# Altium schematic sheet ESP32.SchDoc
size A4
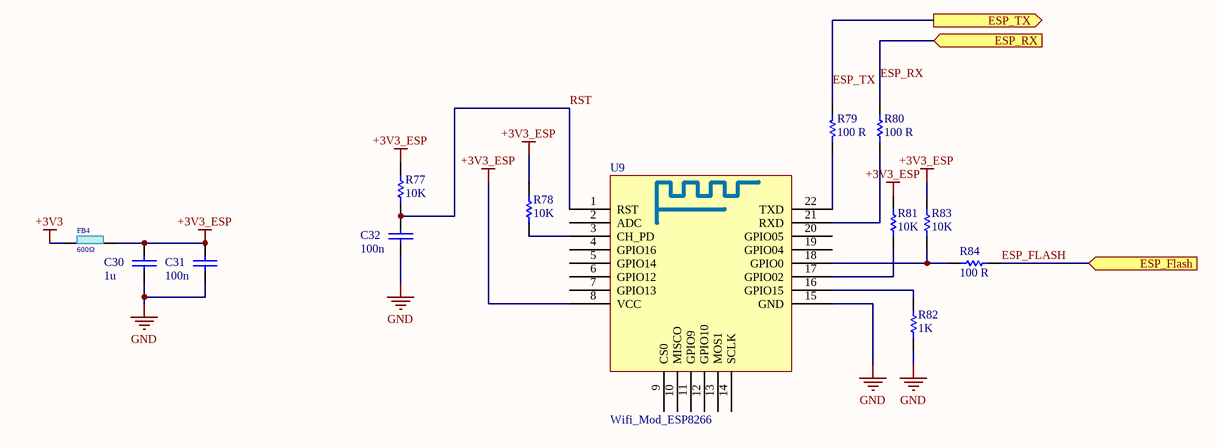
[diagram p0: ESP32.SchDoc]

## Parts
C30  1u  [C1206]
C31  100n  [C1206]
C32  100n  [C1206]
FB4  ZTyp@100MHz: 600Ω  [L1206]  (hidden comment: 0.955u)
R77  10K  [R1206]
R78  10K  [R1206]
R79  100 R  [R1206]
R80  100 R  [R1206]
R81  10K  [R1206]
R82  1K  [R1206]
R83  10K  [R1206]
R84  100 R  [R1206]
U9  Wifi_Mod_ESP8266  [PCBComponent_1 - duplicate]

## Ports
ESP_Flash (in), ESP_RX (in), ESP_TX (out)

## Nets
+3V3: FB4.1
+3V3_ESP: C30.1 C31.1 FB4.2 R77.1 R78.1 R81.1 R83.1 U9.8(VCC)
GND: C30.2 C31.2 C32.2 R82.2 U9.15(GND)
ESP_FLASH: R84.2 ; port ESP_Flash
ESP_RX: R80.2 ; port ESP_RX
ESP_TX: R79.2 ; port ESP_TX
RST: C32.1 R77.2 U9.1(RST)
NetR78_2: R78.2 U9.3(CH_PD)
NetR79_1: R79.1 U9.22(TXD)
NetR80_1: R80.1 U9.21(RXD)
NetR81_2: R81.2 U9.17(GPIO02)
NetR82_1: R82.1 U9.16(GPIO15)
NetR83_2: R83.2 R84.1 U9.18(GPIO0)

Not connected (* = marked no-connect by the designer): U9 2(ADC) 4(GPIO16) 5(GPIO14) 6(GPIO12) 7(GPIO13) 9(CS0) 10(MISCO) 11(GPIO9) 12(GPIO10) 13(MOS1) 14(SCLK) 19(GPIO04) 20(GPIO05)

## Library data of the parts
C30-C32 = CAP: Capacitor
FB4 = FB BLM31P 600: SMD 1206 1.5A 600Ω/80mΩ; Part Number: BLM31PG601SN1L; Manufacturer: Murata; TYPE: Ferrite Bead; Ind: 0.955uH; DC Resistance: 80mΩ; Material: Ferrite; Package-mm: 3216; Tolerance %: ±25%; Temperature Range: -55°C ~ +125°C; Imax: 1.5A; Irms: *; Isat: *; Technology: Chip; Published: 07.04.2019; Publisher: Hefest; Mount Type: SMT; Package: 1206; ComponentLink1Description: Datasheet Link; ComponentLink1URL: https://store.comet.bg/download-file.php?id=5324; RoHS: Y; Ztyp@1GHz: *; Manufacturer Alternate: *; Supplier 1: Comet; Supplier Part Number 1: BLM31PG601SN1L; Part Number Alternate: *; Price: 0.161; Value: 0.955u
R77-R84 = Res1: Resistor; Published: 8-Jun-2000; LatestRevisionDate: 17-Jul-2002; LatestRevisionNote: Re-released for DXP Platform.; PackageReference: AXIAL-0.3; Publisher: Altium Limited